# Altium project Reboostv2.PrjPcb
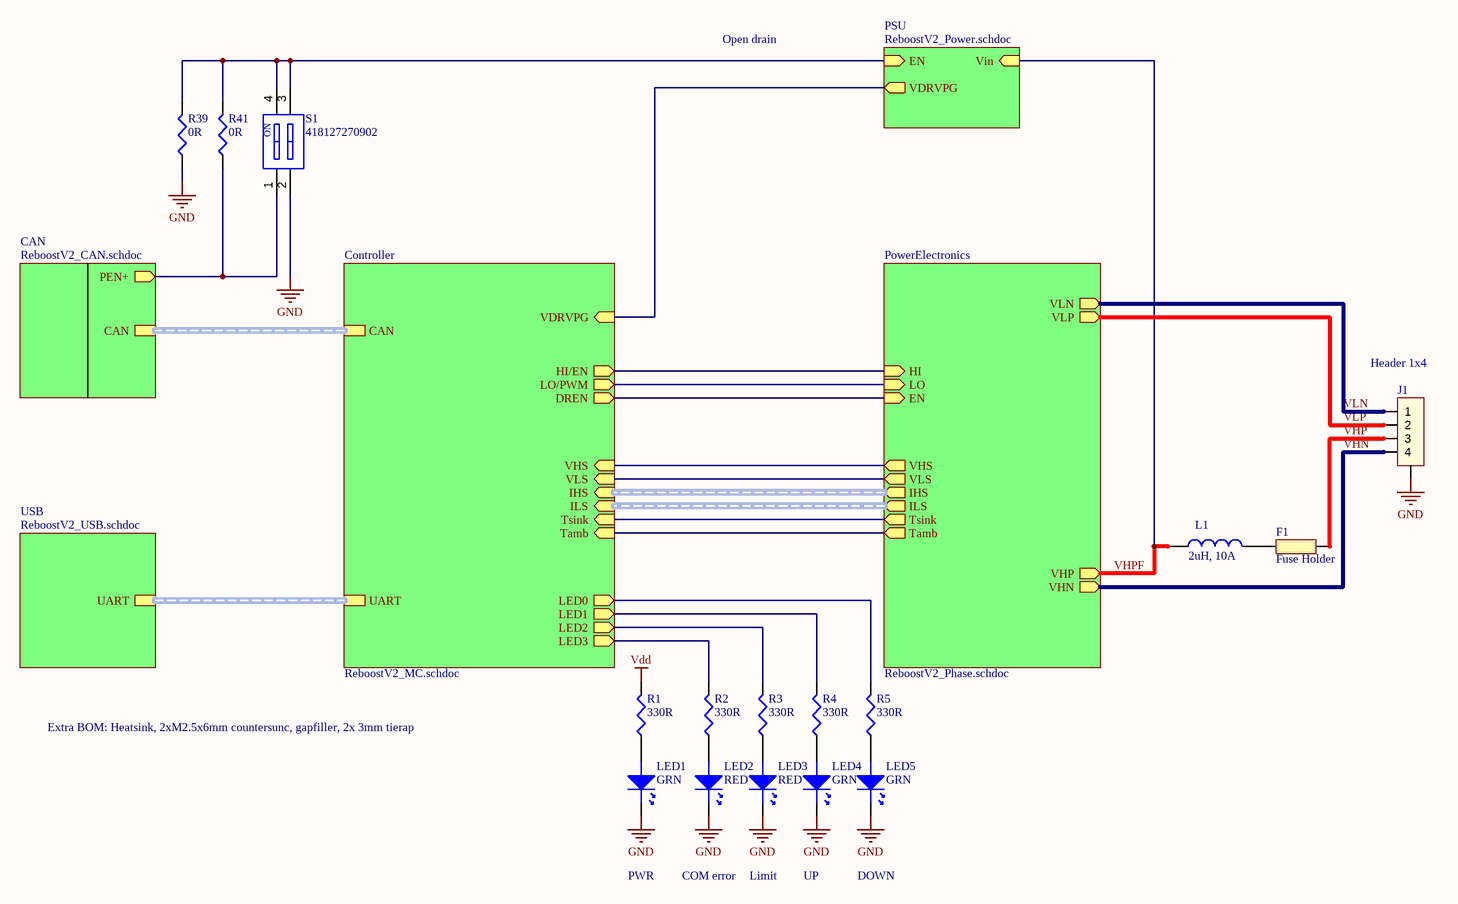
[diagram p0: ReboostV2_toplevel.SchDoc]
9 sheets, 177 parts. Net scope: hierarchical (ports join the sheet entries above them; power ports are global).
Board files: ReboostV2.PcbDoc, ReboostV2.1.PcbDoc
Sheets:
  ReboostV2_toplevel.SchDoc
    CAN = ReboostV2_CAN.SchDoc
    USB = ReboostV2_USB.SchDoc
    Controller = ReboostV2_MC.SchDoc
    PowerElectronics = ReboostV2_Phase.SchDoc
      ILS = ReboostV2__Isense.SchDoc
      IHS = ReboostV2__Isense.SchDoc
      VLS = ReboostV2__Vsense.SchDoc
      VHS = ReboostV2__Vsense.SchDoc
      Designator = ReboostV2_Bridge.SchDoc
    PSU = ReboostV2_Power.SchDoc

## Sheet ReboostV2_toplevel.SchDoc: ReboostV2 Top Sheet
size 420 x 297 mm; SheetNumber: 1

### Parts
F1  Fuse Holder  [Fuse5x20TH]
J1  Header 1x4  [PC 4/ 4-G-7,62]
L1  2uH, 10A  [744710210]
LED1  GRN  [WL-SMRW_1206 cylindrical_Reverse use]
LED2  RED  [WL-SMRW_1206 cylindrical_Reverse use]
LED3  RED  [WL-SMRW_1206 cylindrical_Reverse use]
LED4  GRN  [WL-SMRW_1206 cylindrical_Reverse use]
LED5  GRN  [WL-SMRW_1206 cylindrical_Reverse use]
R1  330R  [0603]
R2  330R  [0603]
R3  330R  [0603]
R4  330R  [0603]
R5  330R  [0603]
R39  0R  [0603]
R41  0R  [0603]
S1  418127270902  [418127270902]

### Sub-sheets
CAN = ReboostV2_CAN.schdoc: CAN, PEN+ (out)
Controller = ReboostV2_MC.schdoc: CAN (harness CAN), HI/EN (out), LO/PWM (out), UART (harness UART), LED1 (out), LED2 (out), LED3 (out), LED0 (out), VHS (in), VLS (in), Tsink (in), IHS (in, harness DP), ILS (in, harness DP), Tamb (in), DREN (out), VDRVPG (in)
PowerElectronics = ReboostV2_Phase.schdoc: VLP (out), VHP (out), Tsink (out), IHS (out), VHS (out), ILS (out), VLS (out), VHN (out), VLN (out), Tamb (out), HI (in), LO (in), EN (in)
PSU = ReboostV2_Power.schdoc: Vin (in), EN (in), VDRVPG (out)
USB = ReboostV2_USB.schdoc: UART (harness SERIAL)

### Nets
GND: J1.0 LED1.1(K) LED2.1(K) LED3.1(K) LED4.1(K) LED5.1(K) R39.1 S1.2
Vdd: R1.2
DREN: sheet Controller/DREN, sheet PowerElectronics/EN
HI: sheet Controller/HI/EN, sheet PowerElectronics/HI
LED0: R5.2 ; sheet Controller/LED0
LED1: R4.2 ; sheet Controller/LED1
LED2: R3.2 ; sheet Controller/LED2
LED3: R2.2 ; sheet Controller/LED3
LO: sheet Controller/LO/PWM, sheet PowerElectronics/LO
Tamb: sheet Controller/Tamb, sheet PowerElectronics/Tamb
Tsink: sheet Controller/Tsink, sheet PowerElectronics/Tsink
VDRVPG: sheet Controller/VDRVPG, sheet PSU/VDRVPG
VHN: J1.4 ; sheet PowerElectronics/VHN
VHP: F1.2 J1.3
VHPF: L1.1 ; sheet PowerElectronics/VHP, sheet PSU/Vin  [project net Vb]
VHS: sheet Controller/VHS, sheet PowerElectronics/VHS
VLN: J1.1 ; sheet PowerElectronics/VLN
VLP: J1.2 ; sheet PowerElectronics/VLP
VLS: sheet Controller/VLS, sheet PowerElectronics/VLS
NetD4_4: R41.1 S1.1 ; sheet CAN/PEN+
NetF1_1: F1.1 L1.2
NetLED1_2: LED1.2(A) R1.1
NetLED2_2: LED2.2(A) R2.1
NetLED3_2: LED3.2(A) R3.1
NetLED4_2: LED4.2(A) R4.1
NetLED5_2: LED5.2(A) R5.1
NetR38_2: R39.2 R41.2 S1.3 S1.4 ; sheet PSU/EN

### Buses and harness runs
harness sheet CAN/CAN = sheet Controller/CAN
harness sheet Controller/IHS = sheet PowerElectronics/IHS
harness sheet Controller/ILS = sheet PowerElectronics/ILS
harness sheet Controller/UART = sheet USB/UART

### Notes on the sheet
- Open drain
- Extra BOM: Heatsink, 2xM2.5x6mm countersunc, gapfiller, 2x 3mm tierap
- PWR
- COM error
- Limit
- UP
- DOWN
- PROJECT
- www.tpee.nl <http://www.tpee.nl>
- TITLE
- FILE NAME
- A3
- SIZE
- Author:
- SHEET
- OF
- (in symbol 418127270902) ON

### Library data of the parts
F1 = 0031.8201: Fuse, Holder, 10A, 250V, T:-40°C +85°C; Brand: SCHURTER; Price: 0,43; Order Code Supplier: 1162740; Brand Number: 0031.8201; Supplier: Farnell
J1 = PC 4/4-G-7,62_1: Header, Close Horizontal, 1x4, Male, 7.62mm, TH; Brand: PHOENIX CONTACT; Brand Number: PC 4/4-G-7,62; Case Style: *; Order Code Supplier: 1792930; Pitch: 7.62mm; Price: 2,92; Supplier: Farnell
L1 = 744710210: WE-SD Rod Core Choke, 2uH, 10A; Manufacturer: Wurth Elektronik; DC Resistance: 3.8mOhm; ComponentLink1Description: Manufacturer; ComponentLink1URL: http://www.we-online.de; ComponentLink2Description: Datasheet; ComponentLink2URL: https://www.we-online.com/catalog/datasheet/744710210.pdf; Operating Temperature: -40 to +150degC; Packaging: Carton; Published Date: April 2020; Inductance: 2uH; Manufacturer Part Number: 744710210; Mounting Technology: THT; Rated Current: 10A
LED1 LED4 LED5 = 156120GS75300: LED, Reverse Mount, Cylindrical, Green; Brand: Wurth; Order Code Supplier: 2322091; Supplier: Farnell; Price: 0,519; Brand Number: 156120GS75300
LED2 LED3 = 156120RS75300: LED, Reverse Mount, Cylindrical, Red; Brand: Wurth; Order Code Supplier: 2322094; Supplier: Farnell; Price: 0,519; Brand Number: 156120RS75300
R1-R5 = 330/0603/0063W/50V: Resistor, 330R, 1%, 0.063W, 50V, 100PPM, 0603; Brand: VISHAY DRALORIC; Brand Number: CRCW0603330RFKEA; Case Style: 0603; Order Code Supplier: 2122302; Power Rating: 0.063W; Price: 0,038; Resistance: 330R; Supplier: Farnell; Temperature Coefficient: ± 100PPM; Temperature Range: -55°C to +125°C; Voltage Rating: 50V
R39 R41 = 0/0603/0063W/50V: Resistor, 0R, 0.1%, 0.063W, 50V, 200PPM, 0603; Brand: VISHAY DRALORIC; Brand Number: CRCW06030000Z0EA; Case Style: 0603; Order Code Supplier: 2122112; Power Rating: 0.063W; Price: 0,043; Resistance: 0R; Supplier: Farnell; Temperature Coefficient: ± 200PPM; Temperature Range: -55°C to +125°C; Voltage Rating: 50V
S1 = 418127270902: WS-DITV Small Compact THT Dip Switch, Raised Actuator, pitch 2.54mm, 2p; Operation Force: 600g; Pole Number: 2; Actuator Type: Raise Type; Circuit: SPST-NO; Rated Current Switching: 25mA; Rated Current Non-Switching: 100mA; Rated Voltage Non-Switching: 50VDC; Rated Voltage Switching: 24VDC; ComponentLink1Description: Manufacturer; ComponentLink1URL: http://www.we-online.de; ComponentLink2Description: Datasheet; ComponentLink2URL: https://katalog.we-online.com/em/datasheet/418127270902.pdf; Pitch: 2.54mm; Contact Material: Copper Alloy; Mounting Technology: THT; Operating Temperature: -40 to +85degC; Contact Plating: Gold; Packaging: Tube; Part Number: 418127270902; Publisher: Wurth Elektronik; Published Date: September 2019

## Sheet ReboostV2_CAN.SchDoc: CAN
size 420 x 297 mm; SheetNumber: 9
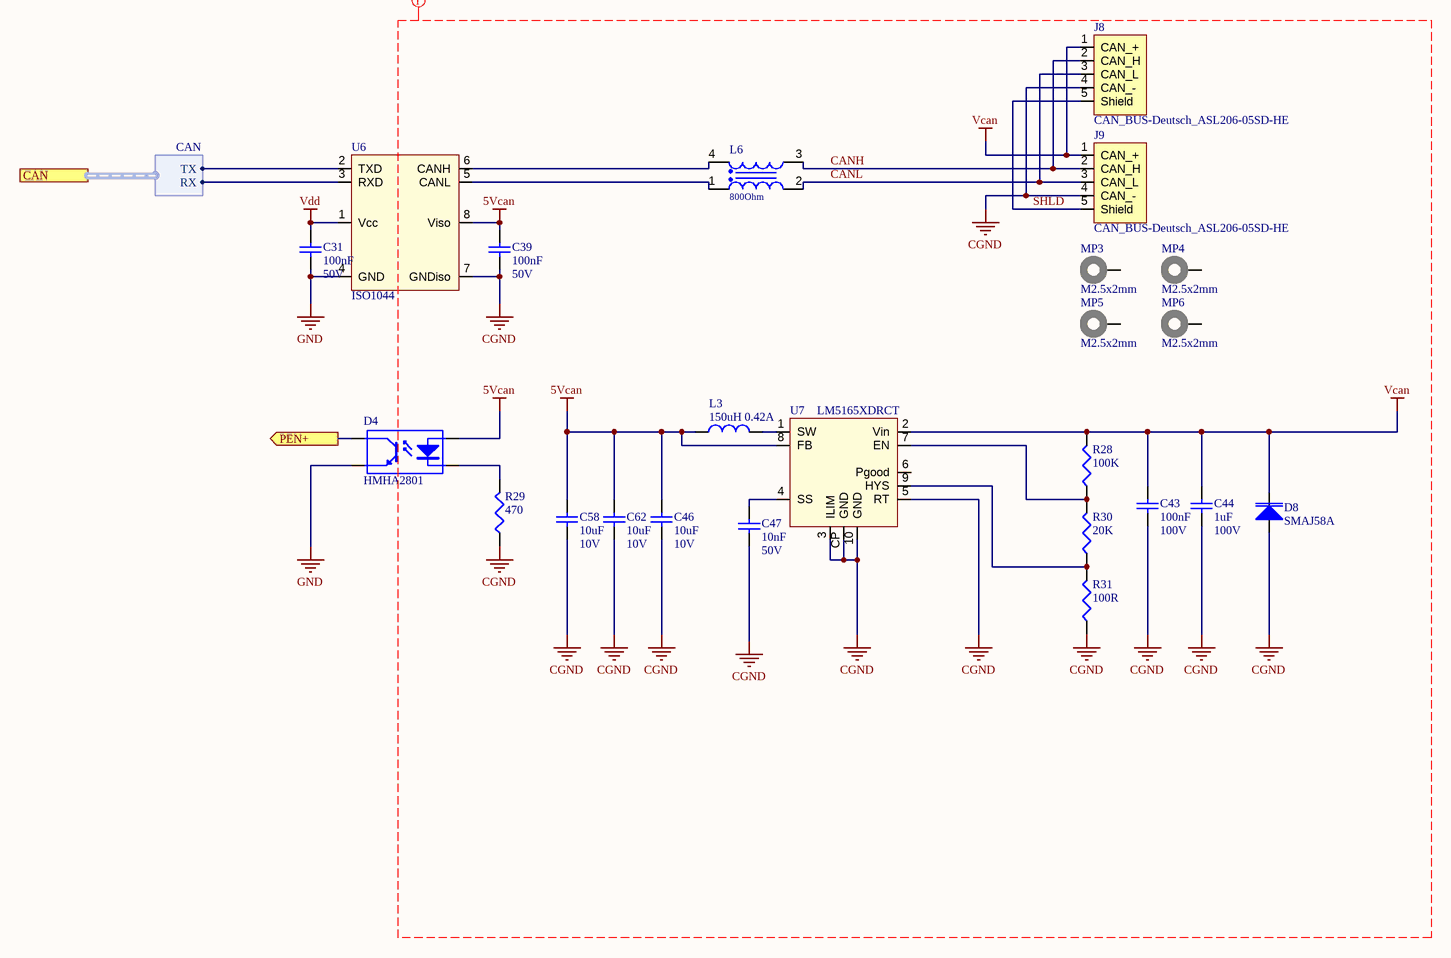
[diagram p1: ReboostV2_CAN.SchDoc]

### Parts
C31  100nF  Voltage Rating: 50V  [C0603]
C39  100nF  Voltage Rating: 50V  [C0603]
C43  100nF  Voltage Rating: 100V  [C-0805]
C44  1uF  Voltage Rating: 100V  [C-1206]
C46  10uF  Voltage Rating: 10V  [C-0805]
C47  10nF  Voltage Rating: 50V  [C0603]
C58  10uF  Voltage Rating: 10V  [C-0805]
C62  10uF  Voltage Rating: 10V  [C-0805]
D4  HMHA2801  [FSOP4]
D8  SMAJ58A  [SMA]
J8  CAN_BUS-Deutsch_ASL206-05SD-HE  [ASL206-05SD-HE]
J9  CAN_BUS-Deutsch_ASL206-05SD-HE  [ASL206-05SD-HE]
L3  150uH 0.42A  [WE-TPC 4828, MH]
L6  800Ohm  [WE-CNSW_1812]
MP3  M2.5x2mm  [9774020151]
MP4  M2.5x2mm  [9774020151]
MP5  M2.5x2mm  [9774020151]
MP6  M2.5x2mm  [9774020151]
R28  100K  [0603]
R29  470  [0603]
R30  20K  [0603]
R31  100R  [0603]
U6  ISO1044  [SO-8]
U7  LM5165XDRCT  [PWSON10]

### Ports
CAN (harness CAN), PEN+ (out)

### Harnesses
CAN: TX, RX

### Nets
5Vcan: C39.2 C46.2 C58.2 C62.2 D4.1(A1) L3.2 U6.8(Viso) U7.8(FB)
CGND: C39.1 C43.1 C44.1 C46.1 C47.1 C58.1 C62.1 D8.1 J8.4(CAN_-) J9.4(CAN_-) R29.1 R31.1 U6.7(GNDiso) U7.3(ILIM) U7.5(RT) U7.10(GND) U7.CP(GND)
GND: C31.1 D4.3(E1) U6.4(GND)
Vcan: C43.2 C44.2 D8.2 J8.1(CAN_+) J9.1(CAN_+) R28.2 U7.2(Vin)
Vdd: C31.2 U6.1(Vcc)
CANH: J8.2(CAN_H) J9.2(CAN_H) L6.3
CANL: J8.3(CAN_L) J9.3(CAN_L) L6.2
CANRX: U6.3(RXD) ; port CAN.RX
CANTX: U6.2(TXD) ; port CAN.TX
SHLD: J8.5(Shield) J9.5(Shield)
NetC47_2: C47.2 U7.4(SS)
NetD4_2: D4.2(K1) R29.2
NetD4_4: D4.4(C1) ; port PEN+
NetL3_1: L3.1 U7.1(SW)
NetL6_1: L6.1 U6.5(CANL)
NetL6_4: L6.4 U6.6(CANH)
NetR28_1: R28.1 R30.2 U7.7(EN)
NetR30_1: R30.1 R31.2 U7.9(HYS)

Not connected (* = marked no-connect by the designer): MP3 1; MP4 1; MP5 1; MP6 1; U7 6(Pgood)

### Layout directives
net class CANISO: 5Vcan, CANH, CANL, CGND, SHLD, Vcan

### Notes on the sheet
- PROJECT
- www.tpee.nl <http://www.tpee.nl>
- TITLE
- FILE NAME
- A3
- SIZE
- Author:
- SHEET
- OF

### Library data of the parts
C31 C39 = 100nF/0603/CER/50V: Capacitor, 100nF, 50V, X7R; Capacitance Tolerance: ± 10%; Capacitor Case Style: 0603; Brand Number: MCCA000255; Brand: MULTICOMP; Dielectric Characteristic: X7R; Capacitance: 100nF; Temperature Range: -55°C to +125°C; Price: 0,008; Order Code Supplier: 1759122RL; Supplier: Farnell
C43 = 100nF/0805/CER/100V: Capacitor, 100nF, 100V, X7R; Capacitance Tolerance: ± 10%; Capacitor Case Style: 0805; Brand Number: C0805C104K1RACTU; Brand: KEMET; Dielectric Characteristic: X7R; Capacitance: 100nF; Temperature Range: -55°C to +125°C; Price: 0,096; Order Code Supplier: 1650862; Supplier: Farnell
C44 = 1uF/1206/CER/100V: Capacitor, 1uF, 100V, X7R; Capacitance Tolerance: ± 10%; Capacitor Case Style: 1206; Brand Number: 12061C105K4Z2A; Brand: AVX; Dielectric Characteristic: X7R; Capacitance: 1uF; Temperature Range: -55°C to +125°C; Price: 0,52; Order Code Supplier: 1833855; Supplier: Farnell
C46 C58 C62 = 10uF/0805/CER/10V: Capacitor, 10uF, 10V, X7R; Capacitance Tolerance: ± 10%; Capacitor Case Style: 0805; Brand Number: GRM21BR71A106KE51L; Brand: MURATA; Dielectric Characteristic: X7R; Capacitance: 10uF; Temperature Range: -55°C to +125°C; Price: 0,36; Order Code Supplier: 1828828; Supplier: Farnell
C47 = 10nF/0603/CER/50V: Capacitor, 10nF, 50V, X7R; Capacitance Tolerance: ± 10%; Capacitor Case Style: 0603; Brand Number: C0603C103K5RACTU; Brand: KEMET; Dielectric Characteristic: X7R; Capacitance: 10nF; Temperature Range: -55°C to +125°C; Price: 0,011; Order Code Supplier: 1414609; Supplier: Farnell
D4 = HMHA2801: Optocoupler, Vout:80V, Iin:0.01A; Brand: FAIRCHILD SEMICONDUCTOR; Isolation Voltage: 2500V; Input Current: 0.01A; Output Voltage: 80V; Brand Number: HMHA2801; Case Style: *; Price: 0,28; Order Code Supplier: 1652504; Supplier: Farnell; Temperature Range: -55°C to +100°C
D8 = SMAJ58A: Diode TVS, Vrwm: 58V, Vbr: 71.2V, Vc: 93.6V, Ippm: 4.3A; Brand: MULTICOMP; Brand Number: SMAJ58A; Breakdown Voltage: 71.2V; Case Style: SMA; Clamping Voltage: 93.6V; Ippm: 4.3A; Order Code Supplier: 1579005; Price: 0,166; Supplier: Farnell; Temperature Range: -55°C to +150°C; Vrwm: 58V
J8 J9 = CMP-024-0003-1: Design Item ID: CAN_BUS-Deutsch_ASL206-05SD-HE; Source: Deutsch_lib.SchLib
L3 = 744043151: 150UH, 30%, 0.42A; Brand: Wurth; Case Style: WE-TPC 4828; DC Resistance: 0.770ohm; Brand Number: 744043151; DC Current: 0.42A; Inductance: 150uH; Order Code Supplier: 2082517; Price: 1,36; Q Factor: *; Supplier: Farnell; Temperature Range: -40°C to +125°C
L6 = 744235801: WE-CNSW SMT Common Mode Line Filter, size 1812, 800Ohm, 1A, 60V; Manufacturer: Wurth Elektronik; DC Resistance max.: 0.12Ohm; Impedance Test Condition: 100MHz; Insulation Test Voltage: 125VAC; Winding Style: bifiliar; ComponentLink1Description: Manufacturer; ComponentLink1URL: http://www.we-online.de; ComponentLink2Description: Datasheet; ComponentLink2URL: https://www.we-online.com/catalog/datasheet/744235801.pdf; Operating Temperature: -40 to +125degC; Packaging: Tape and Reel; Published Date: April 2020; Rated Current: 1A; Size: 1812; Impedance: 800Ohm; Manufacturer Part Number: 744235801; Rated Voltage: 60V; Mounting Technology: SMT
MP3-MP6 = 9774020151: WA-SMSI SMT Steel Spacer, M2.5 Thread Internal, OD 5.1mm, M2.5x2mm; Manufacturer: Wurth Elektronik; Inner Diameter: 3.5mm; Surface: Tin; ComponentLink1Description: Manufacturer; ComponentLink1URL: http://www.we-online.de; ComponentLink2Description: Datasheet; ComponentLink2URL: https://www.we-online.com/catalog/datasheet/9774020151.pdf; Mounting Technology: SMT; Packaging: Bulk; Manufacturer Part Number: 9774020151; Length: 2mm; Inner Thread Length: -; Operating Temperature: -55 to +150degC; Outer Diameter: 5.1mm; Published Date: April 2020; Material: Steel; Thread: M2.5
R28 = 100K/0603/0063W/50V: Resistor, 100K, 1%, 0.063W, 50V, 100PPM, 0603; Brand: VISHAY DRALORIC; Brand Number: CRCW0603100KFKEA; Case Style: 0603; Order Code Supplier: 2122619; Power Rating: 0.063W; Price: 0,039; Resistance: 100K; Supplier: Farnell; Temperature Coefficient: ± 100PPM; Temperature Range: -55°C to +125°C; Voltage Rating: 50V
R29 = 470/0603/0063W/50V: Resistor, 470, 1%, 0.063W, 50V, 100PPM, 0603; Brand: VISHAY DRALORIC; Brand Number: CRCW0603470RFKEA; Case Style: 0603; Order Code Supplier: 2122323; Power Rating: 0.063W; Price: 0,038; Resistance: 470; Supplier: Farnell; Temperature Coefficient: ± 100PPM; Temperature Range: -55°C to +125°C; Voltage Rating: 50V
R30 = 20K/0603/0063W/50V: Resistor, 20K, 1%, 0.063W, 50V, 100PPM, 0603; Brand: VISHAY DRALORIC; Brand Number: CRCW060320K0FKEA; Case Style: 0603; Order Code Supplier: 2122528; Power Rating: 0.063W; Price: 0,038; Resistance: 20K; Supplier: Farnell; Temperature Coefficient: ± 100PPM; Temperature Range: -55°C to +125°C; Voltage Rating: 50V
R31 = 100/0603/0063W/50V: Resistor, 100R, 1%, 0.063W, 50V, 200PPM, 0603; Brand: VISHAY DRALORIC; Brand Number: CRCW0603100RFKEA; Case Style: 0603; Order Code Supplier: 2122239; Power Rating: 0.063W; Price: 0,007; Resistance: 100R; Supplier: Farnell; Temperature Coefficient: ± 200PPM; Temperature Range: -55°C to +125°C; Voltage Rating: 50V
U6 = ISO1044: ISO1044 Isolated CAN FD Transceiver in Small Package; Supplier 1: Digi-Key; Supplier 2: Mouser; Supplier Part Number 1: 296-ISO1044DEVM-ND; Supplier Part Number 2: 595-ISO1044DEVM
U7 = LM5165X: Buck Vreg 150mA 5Vout 5-65Vin; Brand: Texas Instruments; Case Style: MSOP-8; Price: 3,70; Order Code Supplier: 595-LM5165XDRCT; Brand Number: LM5165XDRCT; Temperature Range: -40°C to +85°C; Supplier: Mouser

## Sheet ReboostV2_USB.SchDoc: USB
size 420 x 297 mm; SheetNumber: 7
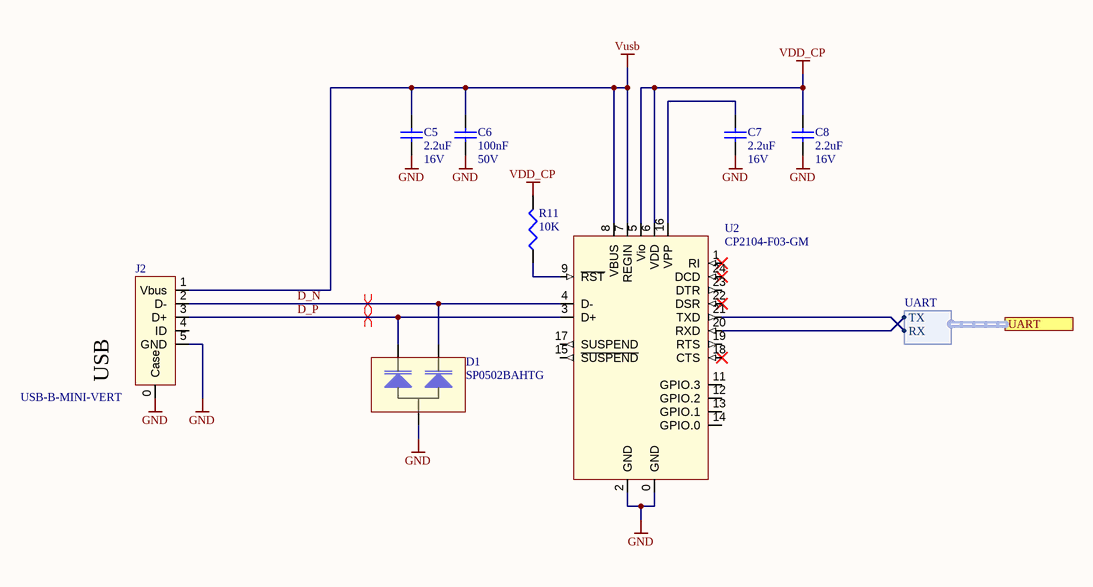
[diagram p2: ReboostV2_USB.SchDoc]

### Parts
C5  2.2uF  Voltage Rating: 16V  [C0603]
C6  100nF  Voltage Rating: 50V  [C0603]
C7  2.2uF  Voltage Rating: 16V  [C0603]
C8  2.2uF  Voltage Rating: 16V  [C0603]
D1  SP0502BAHTG  [SOT23]
J2  USB-B-MINI-VERT  [USB-B-MINI-VERT]
R11  10K  [0603]
U2  CP2104-F03-GM  [QFN24]

### Ports
UART (harness UART)

### Harnesses
UART: RX, TX

### Nets
GND: C5.1 C6.1 C7.1 C8.1 D1.A J2.0(Case) J2.5(GND) U2.0(GND) U2.2(GND)
VDD_CP: C8.2 R11.2 U2.5(Vio) U2.6(VDD)
Vusb: C5.2 C6.2 J2.1(Vbus) U2.7(REGIN) U2.8(VBUS)
D_N: D1.K1 J2.2(D-) U2.4(D-)
D_P: D1.K2 J2.3(D+) U2.3(D+)
RX: U2.21(TXD) ; port UART.RX
TX: U2.20(RXD) ; port UART.TX
NetC7_2: C7.2 U2.16(VPP)
NetR11_1: R11.1 U2.9(~{RST})

Not connected (* = marked no-connect by the designer): J2 4(ID); U2 1(RI)* 11(GPIO.3) 12(GPIO.2) 13(GPIO.1) 14(GPIO.0) 15(~{SUSPEND}) 17(SUSPEND) 18(CTS)* 19(RTS) 22(DSR)* 23(DTR) 24(DCD)*

### Layout directives
differential pair: D_N, D_P

### Notes on the sheet
- (near J2) USB
- PROJECT
- www.tpee.nl <http://www.tpee.nl>
- TITLE
- FILE NAME
- A3
- SIZE
- Author:
- SHEET
- OF

### Library data of the parts
C5 C7 C8 = 2.2uF/0603/CER/16V: Capacitor, 2.2uF, 16V, X5R; Capacitance Tolerance: +/- 10%; Capacitor Case Style: 0603; Brand Number: GRM188R61C225KE15D; Brand: MURATA; Dielectric Characteristic: X5R; Capacitance: 2.2uF; Temperature Range: -55°C to 85°C; Price: 0,077; Order Code Supplier: 1735526; Supplier: Farnell
C6 = 100nF/0603/CER/50V: as C31 on sheet ReboostV2_CAN; Dielectric Characteristic: X7R; Capacitance: 100nF; Temperature Range: -55°C to +125°C; Price: 0,008; Order Code Supplier: 1759122RL; Supplier: Farnell
D1 = SP0502BAHTG: Diode TVS Dual, Vrwm: 5.5V Vc: 8V; Brand: LITTLEFUSE; Case Style: SOT-23; Brand Number: SP0502BAHTG; Clamping Voltage: 8V; Order Code Supplier: 1827631; Price: 0,80; Supplier: Farnell; Temperature Range: -40°C to +125°C; Vrwm: 5.5V
J2 = WE-651005136421: Connector, Usb B Mini, Vertical, TH, WR-COM; Brand: WURTH ELEKTRONIK; Brand Number: 651005136421; Case Style: WR-COM; Order Code Supplier: 1841175; Pitch: *; Price: 3,37; Supplier: Farnell
R11 = 10K/0603/0063W/50V: Resistor, 10K, 1%, 0.063W, 50V, 100PPM, 0603; Brand: VISHAY DRALORIC; Brand Number: CRCW060310K0FKEA; Case Style: 0603; Order Code Supplier: 2122493; Power Rating: 0.063W; Price: 0,038; Resistance: 10K; Supplier: Farnell; Temperature Coefficient: ± 100PPM; Temperature Range: -55°C to +125°C; Voltage Rating: 50V
U2 = CP2104-F03-GM: USB to UART converter; Brand: Silicon Labs; Case Style: QFN24; Price: 1,65; Order Code Supplier: 757-4983; Brand Number: CP2104-F03-GM; Supplier: RS-Components

## Sheet ReboostV2_MC.SchDoc: Microcontroller
size 420 x 297 mm; SheetNumber: 6
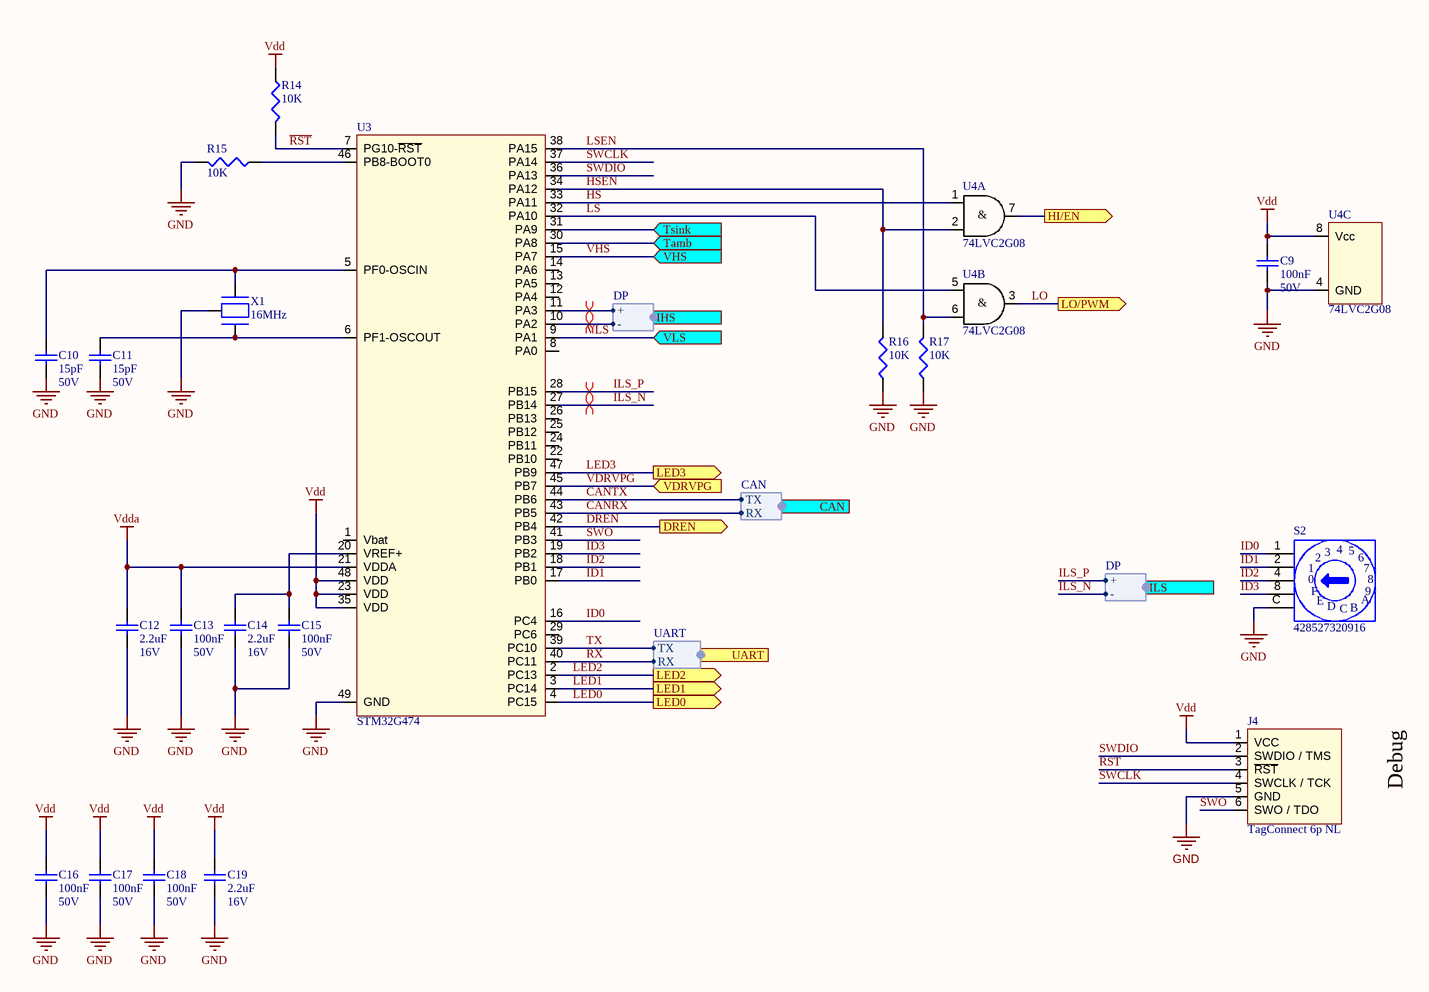
[diagram p3: ReboostV2_MC.SchDoc]

### Parts
C9  100nF  Voltage Rating: 50V  [C0603]
C10  15pF  Voltage Rating: 50V  [C0603]
C11  15pF  Voltage Rating: 50V  [C0603]
C12  2.2uF  Voltage Rating: 16V  [C0603]
C13  100nF  Voltage Rating: 50V  [C0603]
C14  2.2uF  Voltage Rating: 16V  [C0603]
C15  100nF  Voltage Rating: 50V  [C0603]
C16  100nF  Voltage Rating: 50V  [C0603]
C17  100nF  Voltage Rating: 50V  [C0603]
C18  100nF  Voltage Rating: 50V  [C0603]
C19  2.2uF  Voltage Rating: 16V  [C0603]
J4  TagConnect 6p NL  [TC2030-IDC-NL]  (no BOM)
R14  10K  [0603]
R15  10K  [0603]
R16  10K  [0603]
R17  10K  [0603]
S2  428527320916  [42852732091x_16p]
U3  STM32G474  [QFN48]
U4  74LVC2G08  [TSSOP8]  (parts A,B,C of 3)
X1  16MHz  [7M]

### Ports
CAN (harness CAN), DREN (out), HI/EN (out), IHS (harness DP), ILS (harness DP), LED0 (out), LED1 (out), LED2 (out), LED3 (out), LO/PWM (out), Tamb (in), Tsink (in), UART (harness UART), VDRVPG (in), VHS (in), VLS (in)

### Harnesses
CAN: RX, TX
UART: RX, TX
DP: +, -

### Nets
GND: C9.1 C10.1 C11.1 C12.1 C13.1 C14.1 C15.1 C16.1 C17.1 C18.1 C19.1 J4.5(GND) R15.2 R16.1 R17.1 S2.C U3.49(GND) U4.4(GND) X1.0
Vdd: C9.2 C16.2 C17.2 C18.2 C19.2 J4.1(VCC) R14.1 U3.23(VDD) U3.35(VDD) U3.48(VDD) U4.8(Vcc)
Vdda: C12.2 C13.2 U3.21(VDDA)
_N: U3.10(PA2) ; port IHS.-
_P: U3.11(PA3) ; port IHS.+
CANRX: U3.43(PB5) ; port CAN.RX
CANTX: U3.44(PB6) ; port CAN.TX
DREN: U3.42(PB4) ; port DREN
HI: U4.7(Y) ; port HI/EN
HS: U3.33(PA11) U4.1(A)
HSEN: R16.2 U3.34(PA12) U4.2(B)
ID0: S2.1 U3.16(PC4)
ID1: S2.2 U3.17(PB0)
ID2: S2.4 U3.18(PB1)
ID3: S2.8 U3.19(PB2)
ILS_N: U3.27(PB14) ; port ILS.-  [project net _N]
ILS_P: U3.28(PB15) ; port ILS.+  [project net _P]
LED0: U3.4(PC15) ; port LED0
LED1: U3.3(PC14) ; port LED1
LED2: U3.2(PC13) ; port LED2
LED3: U3.47(PB9) ; port LED3
LO: U4.3(Y) ; port LO/PWM
LS: U3.32(PA10) U4.5(A)
LSEN: R17.2 U3.38(PA15) U4.6(B)
~{RST}: J4.3(~{RST}) R14.2 U3.7(PG10-~{RST})
RX: U3.40(PC11) ; port UART.RX
SWCLK: J4.4(SWCLK_/_TCK) U3.37(PA14)
SWDIO: J4.2(SWDIO_/_TMS) U3.36(PA13)
SWO: J4.6(SWO_/_TDO) U3.41(PB3)
Tamb: U3.30(PA8) ; port Tamb
Tsink: U3.31(PA9) ; port Tsink
TX: U3.39(PC10) ; port UART.TX
VDRVPG: U3.45(PB7) ; port VDRVPG
VHS: U3.15(PA7) ; port VHS
VLS: U3.9(PA1) ; port VLS
NetC10_2: C10.2 U3.5(PF0-OSCIN) X1.1
NetC11_2: C11.2 U3.6(PF1-OSCOUT) X1.2
NetC14_2: C14.2 C15.2 U3.20(VREF+)
NetR15_1: R15.1 U3.46(PB8-BOOT0)

Not connected (* = marked no-connect by the designer): U3 1(Vbat) 8(PA0) 12(PA4) 13(PA5) 14(PA6) 22(PB10) 24(PB11) 25(PB12) 26(PB13) 29(PC6)

### Layout directives
differential pair: _N, _P

### Notes on the sheet
- Debug
- PROJECT
- www.tpee.nl <http://www.tpee.nl>
- TITLE
- FILE NAME
- A3
- SIZE
- Author:
- SHEET
- OF
- (in symbol 74LVC2G08, part A) &
- (in symbol 74LVC2G08, part B) &
- (in symbol 428527320916) 5; 3; 6; 7; 0; F; 9; E; A; D; B

### Library data of the parts
C9 C13 C15-C18 = 100nF/0603/CER/50V: as C31 on sheet ReboostV2_CAN; Dielectric Characteristic: X7R; Capacitance: 100nF; Temperature Range: -55°C to +125°C; Price: 0,008; Order Code Supplier: 1759122RL; Supplier: Farnell
C10 C11 = 15pF/0603/CER/50V: Capacitor, 15pF, 50V, C0G / NP0; Capacitance Tolerance: ± 5%; Capacitor Case Style: 0603; Brand Number: MCCA000194; Brand: MULTICOMP; Dielectric Characteristic: C0G / NP0; Capacitance: 15pF; Temperature Range: -55°C to +125°C; Price: 0,009; Order Code Supplier: 1759055; Supplier: Farnell
C12 C14 C19 = 2.2uF/0603/CER/16V: as C5 on sheet ReboostV2_USB; Dielectric Characteristic: X5R; Capacitance: 2.2uF; Temperature Range: -55°C to 85°C; Price: 0,077; Order Code Supplier: 1735526; Supplier: Farnell
J4 = TC2030-IDC: “No Legs” 6-pin Plug-of-Nails™ Cable fitted with a 6-pin 0.1″ pitch ribbon connector.
R14-R17 = 10K/0603/0063W/50V: as R11 on sheet ReboostV2_USB; Case Style: 0603; Order Code Supplier: 2122493; Power Rating: 0.063W; Price: 0,038; Resistance: 10K; Supplier: Farnell; Temperature Coefficient: ± 100PPM; Temperature Range: -55°C to +125°C; Voltage Rating: 50V
S2 = 428527320916: WS-ROTV THT Rotary Switch with Arrow Type Actuator, 10x10mm, 16 positions; Rated Current: 150mA; Cover Material: PA66; Position Number: 16; Washable: Yes; Rated Voltage: 24VDC; ComponentLink1Description: Manufacturer; ComponentLink1URL: http://www.we-online.de; ComponentLink2Description: Datasheet; ComponentLink2URL: https://katalog.we-online.com/em/datasheet/428527320916.pdf; Part Number: 428527320916; Publisher: Wurth Elektronik; Operating Temperature: -40 to +85degC; Packaging: Tube; Mounting Technology: THT; Published Date: September 2019; Size: 10x10mm; Terminal Plating: Gold; Actuator Type: Arrow Type
U3 = STM32G474CEU6: ARM MCU, STM32 Family STM32G4 Series Microcontrollers, ARM Cortex-M4F, 32bit, 170 MHz, 512 KB; Supplier 1: Digi-Key; Supplier 2: Farnell; Supplier Part Number 1: 497-STM32G474CEU6-ND; Supplier Part Number 2: 3132392
U4 = 74LVC2G08: Dual 2-input AND gate; Supplier: Mouser; Order Code Supplier: 771-74LVC2G08DP-G
X1 = 7M-16.000MAAJ-T: CRYSTAL, 16MHz,18PF CL, 3.2X2.5MM SMT; Brand: TXC; Order Code Supplier: 1842060; Price: 1,45; Supplier: Farnell; Brand Number: 7M-16.000MAAJ-T

## Sheet ReboostV2_Phase.SchDoc: Power Electronics
size 420 x 297 mm; DocumentNumber: 2; SheetNumber: 2
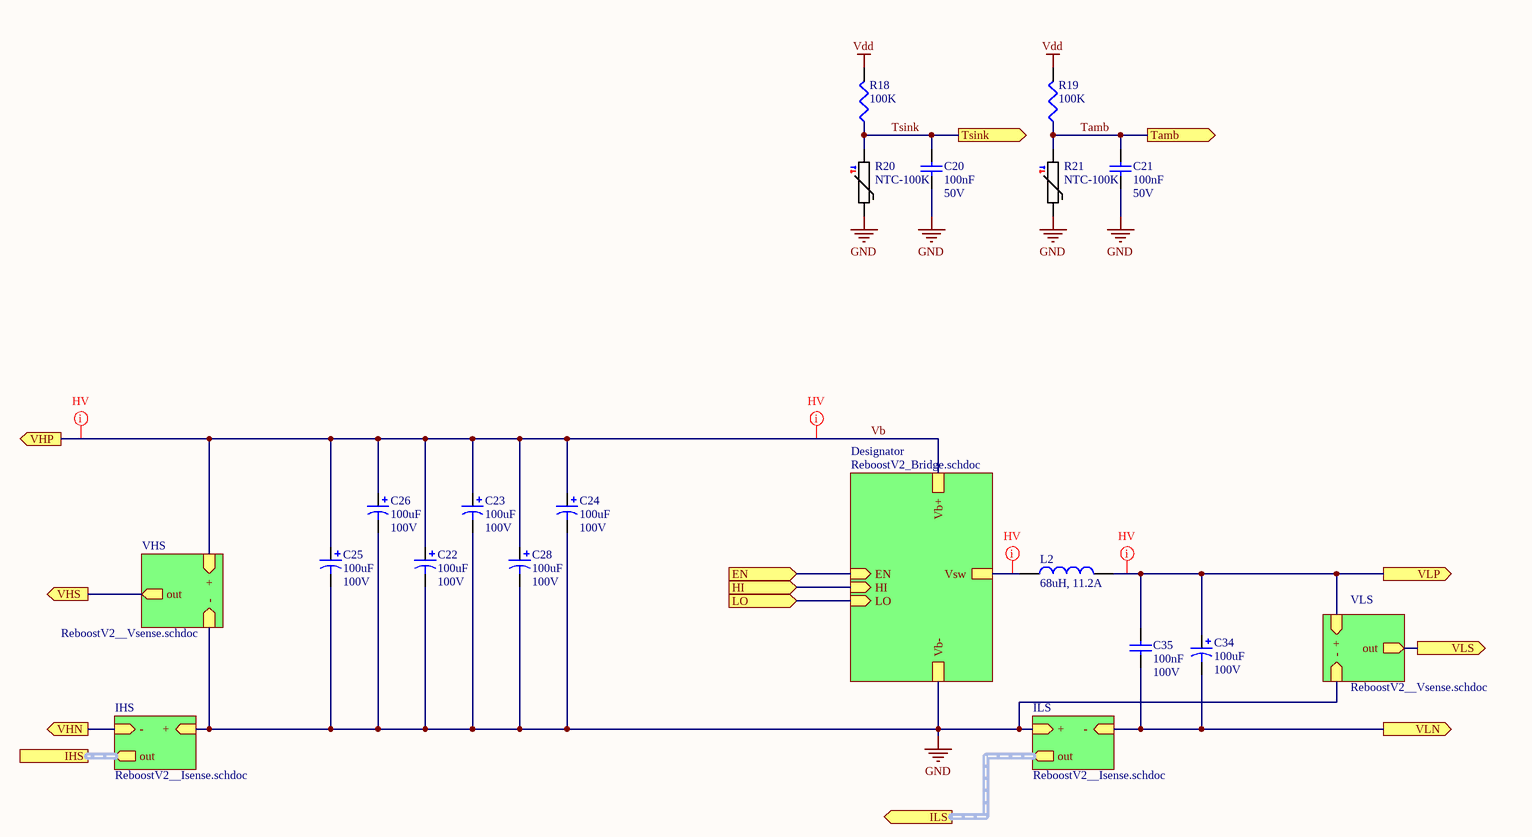
[diagram p4: ReboostV2_Phase.SchDoc]

### Parts
C20  100nF  Voltage Rating: 50V  [C0603]
C21  100nF  Voltage Rating: 50V  [C0603]
C22  100uF  Voltage Rating: 100V  [WCAP-ATUL_10x20x5x0.6]
C23  100uF  Voltage Rating: 100V  [WCAP-ATUL_10x20x5x0.6]
C24  100uF  Voltage Rating: 100V  [WCAP-ATUL_10x20x5x0.6]
C25  100uF  Voltage Rating: 100V  [WCAP-ATUL_10x20x5x0.6]
C26  100uF  Voltage Rating: 100V  [WCAP-ATUL_10x20x5x0.6]
C28  100uF  Voltage Rating: 100V  [WCAP-ATUL_10x20x5x0.6]
C34  100uF  Voltage Rating: 100V  [WCAP-ATUL_10x20x5x0.6]
C35  100nF  Voltage Rating: 100V  [C-0805]
L2  68uH, 11.2A  [WE-HCF_2920]
R18  100K  [0603]
R19  100K  [0603]
R20  NTC-100K  [R0805]
R21  NTC-100K  [R0805]

### Sub-sheets
Designator = ReboostV2_Bridge.schdoc: Vb+, Vsw, Vb-, EN (in), HI (in), LO (in)
IHS = ReboostV2__Isense.schdoc: - (in), + (in), out (out)
ILS = ReboostV2__Isense.schdoc: - (in), + (in), out (out)
VHS = ReboostV2__Vsense.schdoc: + (in), out (out), - (in)
VLS = ReboostV2__Vsense.schdoc: + (in), out (out), - (in)

### Ports
EN (in), HI (in), IHS, ILS (out), LO (in), Tamb (out), Tsink (out), VHN (out), VHP (out), VHS (out), VLN (out), VLP (out), VLS (out)

### Nets
GND: C20.1 C21.1 C22.2 C23.2 C24.2 C25.2 C26.2 C28.2 R20.1 R21.1 ; sheet ILS/+, sheet IHS/+, sheet VLS/-, sheet VHS/-, sheet Designator/Vb-
Vdd: R18.2 R19.2
DREN: port EN, sheet Designator/EN
HI: port HI, sheet Designator/HI
HSS: L2.1 ; sheet Designator/Vsw
LO: port LO, sheet Designator/LO
Tamb: C21.2 R19.1 R21.2 ; port Tamb
Tsink: C20.2 R18.1 R20.2 ; port Tsink
Vb: C22.1 C23.1 C24.1 C25.1 C26.1 C28.1 ; port VHP, sheet VHS/+, sheet Designator/Vb+
VHN: port VHN, sheet IHS/-
VHS: port VHS, sheet VHS/out
VLN: C34.2 C35.1 ; port VLN, sheet ILS/-
VLP: C34.1 C35.2 L2.2 ; port VLP, sheet VLS/+
VLS: port VLS, sheet VLS/out

### Buses and harness runs
harness port IHS = sheet IHS/out
harness port ILS = sheet ILS/out

### Layout directives
net class HV: HSS, Vb, VLP

### Notes on the sheet
- PROJECT
- www.tpee.nl <http://www.tpee.nl>
- TITLE
- FILE NAME
- A3
- SIZE
- Author:
- SHEET
- OF

### Library data of the parts
C20 C21 = 100nF/0603/CER/50V: as C31 on sheet ReboostV2_CAN; Dielectric Characteristic: X7R; Capacitance: 100nF; Temperature Range: -55°C to +125°C; Price: 0,008; Order Code Supplier: 1759122RL; Supplier: Farnell
C22-C26 C28 C34 = 100uF/ALU/100V: Aluminum Electrolytic Capacitor, 100uF, 100V; Capacitance Tolerance: ± 20%; Capacitor Case Style: Radial Leaded 10 x 20; Dielectric Characteristic: *; Capacitance: 100uF; Temperature Range: -40°C to +85°C; Supplier 1: Mouser; Supplier Part Number 1: 661-EKYB101E101MJ20S
C35 = 100nF/0805/CER/100V: as C43 on sheet ReboostV2_CAN; Dielectric Characteristic: X7R; Capacitance: 100nF; Temperature Range: -55°C to +125°C; Price: 0,096; Order Code Supplier: 1650862; Supplier: Farnell
L2 = 74437429203680: WE-HCF SMT High Current Inductor, size 2920, 68uH, 11.2A, 24.42mOhm; Manufacturer: Wurth Elektronik; Self Resonant Frequency: 5.3MHz; DC Resistance typ.: 22.2mOhm; Saturation Current: 10.7A; ComponentLink1Description: Manufacturer; ComponentLink1URL: http://www.we-online.de; ComponentLink2Description: Datasheet; ComponentLink2URL: https://www.we-online.com/catalog/datasheet/74437429203680.pdf; Mounting Technology: SMT; Operating Temperature: -40 to +125degC; Packaging: Tray and Carton; Published Date: September 2020; DC Resistance max.: 24.42mOhm; Inductance: 68uH; Manufacturer Part Number: 74437429203680; Rated Current: 11.2A; Size: 2920
R18 R19 = 100K/0603/0063W/50V: as R28 on sheet ReboostV2_CAN; Case Style: 0603; Order Code Supplier: 2122619; Power Rating: 0.063W; Price: 0,039; Resistance: 100K; Supplier: Farnell; Temperature Coefficient: ± 100PPM; Temperature Range: -55°C to +125°C; Voltage Rating: 50V
R20 R21 = NTCS0805E4104JMT: NTC, 100K, 25°C, 0.5%, 0.210W, 0805; Brand: VISHAY BC COMPONENTS; Case Style: 0805; Brand Number: NTCS0805E4104JMT; Order Code Supplier: 1187095; Power Rating: 0.210W; Price: 0,59; Resistance: 100K; Supplier: Farnell; Temperature Range: -55°C to +150°C; Type: NTC-100K

## Sheet ReboostV2__Isense.SchDoc: Current Sesnor
size 420 x 297 mm; SheetNumber: 4
Used 2 times, as channels PowerElectronics/ILS, PowerElectronics/IHS. Parts and nets are listed once, with the designators drawn on the sheet.
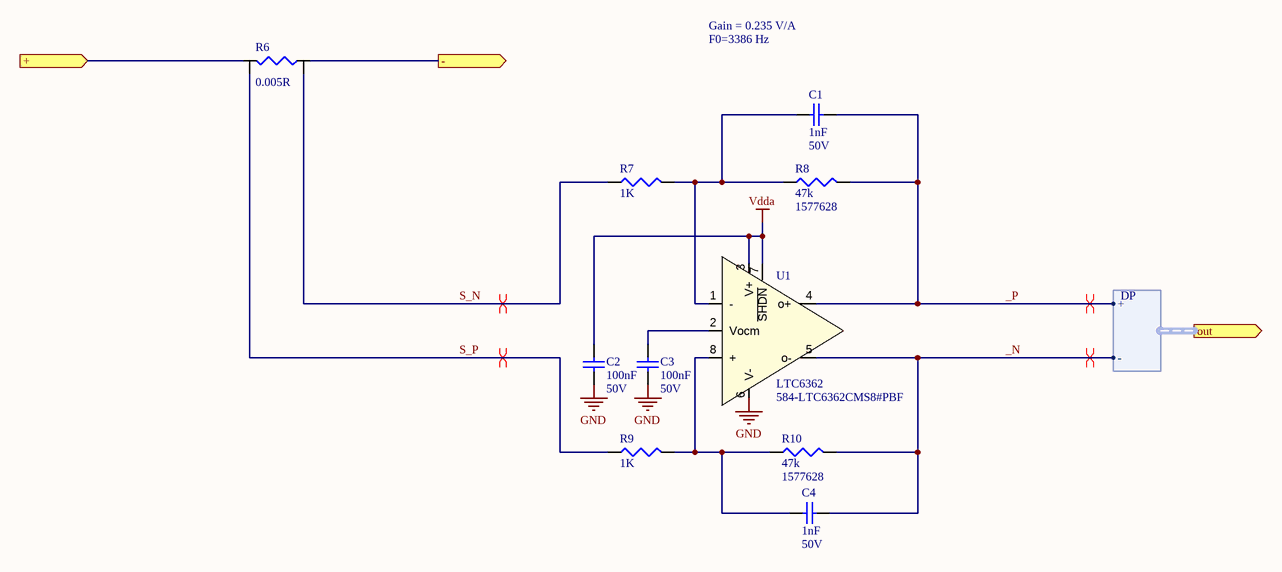
[diagram p5: ReboostV2__Isense.SchDoc]

### Parts
C1  1nF  Voltage Rating: 50V  [C0603]
C2  100nF  Voltage Rating: 50V  [C0603]
C3  100nF  Voltage Rating: 50V  [C0603]
C4  1nF  Voltage Rating: 50V  [C0603]
R6  0.005R  [2512-L-4T]
R7  1K  [0603]
R8  47k  Supplier Part Number 1: 1577628  [0603]
R9  1K  [0603]
R10  47k  Supplier Part Number 1: 1577628  [0603]
U1  LTC6362  Supplier Part Number 1: 584-LTC6362CMS8#PBF  [MSOP8]

### Ports
+ (in), - (out), out (out, harness DP)

### Harnesses
DP: +, -

### Nets
GND: C2.1 C3.1 U1.6(V-)
Vdda: C2.2 U1.3(V+) U1.7(~{SHDN})
+: R6.1 ; port +
-: R6.2 ; port -
_N: C4.2 R10.2 U1.5(o-) ; port out.-
_P: C1.2 R8.2 U1.4(o+) ; port out.+
S_N: R6.4 R7.1
S_P: R6.3 R9.1
NetC1_1: C1.1 R7.2 R8.1 U1.1(-)
NetC3_2: C3.2 U1.2(Vocm)
NetC4_1: C4.1 R9.2 R10.1 U1.8(+)

### Channels
PowerElectronics/ILS: designators end in _ILS; ports +=GND -=VLN
PowerElectronics/IHS: designators end in _IHS; ports +=GND -=VHN

### Layout directives
differential pair: _N, _P, S_N_ILS, S_P_ILS

### Notes on the sheet
- Gain = 0.235 V/A
- F0=3386 Hz
- PROJECT
- www.tpee.nl <http://www.tpee.nl>
- TITLE
- FILE NAME
- A3
- SIZE
- Author:
- SHEET
- OF

### Library data of the parts
C1 C4 = 1nF/0603/CER/50V: Capacitor, 1nF, 50V, X7R; Capacitance Tolerance: ± 10%; Capacitor Case Style: 0603; Brand Number: C0603C102K5RACTU; Brand: KEMET; Dielectric Characteristic: X7R; Capacitance: 1nF; Temperature Range: -55°C to +125°C; Price: 0,011; Order Code Supplier: 1414608; Supplier: Farnell
C2 C3 = 100nF/0603/CER/50V: as C31 on sheet ReboostV2_CAN; Dielectric Characteristic: X7R; Capacitance: 100nF; Temperature Range: -55°C to +125°C; Price: 0,008; Order Code Supplier: 1759122RL; Supplier: Farnell
R6 = 0.005/2512/2000W/200V: Resistor, 0.005R, 1%, 2W, 50PPM; Brand: OHMITE; Brand Number: FC4L64R005FER; Case Style: 2512; Voltage Rating: 200V; Order Code Supplier: 2363991; Power Rating: 2W; Price: 3,07; Resistance: 0.005R; Supplier: Farnell; Temperature Coefficient: ± 50PPM; Temperature Range: -55°C to +170°C
R7 R9 = 1K/0603/0063W/50V: Resistor, 1K, 1%, 0.063W, 50V, 100PPM, 0603; Brand: VISHAY DRALORIC; Brand Number: CRCW06031K00FKEA; Case Style: 0603; Order Code Supplier: 2122366; Power Rating: 0.063W; Price: 0,039; Resistance: 1K; Supplier: Farnell; Temperature Coefficient: ± 100PPM; Temperature Range: -55°C to +125°C; Voltage Rating: 50V
R8 R10 = 47K/0603/0063W/50V_1: Resistor, 47K, 0.1%, 0.063W, 50V, 100PPM, 0603; Case Style: 0603; Power Rating: 0.063W; Resistance: 47k; Supplier: Farnell; Temperature Coefficient: ± 100PPM; Temperature Range: -55°C to +125°C; Voltage Rating: 50V; Supplier 1: Farnell
U1 = LTC6362HMS8: Precision, Low Power Rail-to-Rail Input/Output Differential Op Amp; Supplier 1: Mouser

## Sheet ReboostV2__Vsense.SchDoc: Voltage Sensor
size 420 x 297 mm; SheetNumber: 5
Used 2 times, as channels PowerElectronics/VLS, PowerElectronics/VHS. Parts and nets are listed once, with the designators drawn on the sheet.
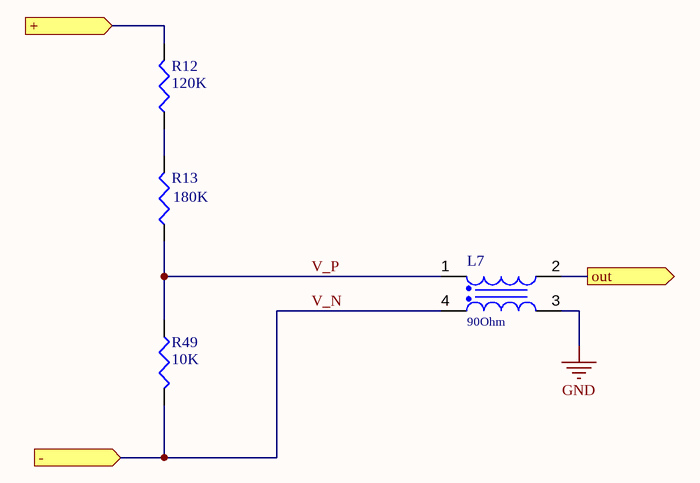
[diagram p6: ReboostV2__Vsense.SchDoc]

### Parts
L7  90Ohm  [WE-CNSW_0805]
R12  120K  [0603]
R13  180K  [0603]
R49  10K  [0603]

### Ports
+ (in), - (in), out (out)

### Nets
GND: L7.3
+: R12.2 ; port +
out: L7.2 ; port out
V_N: L7.4 R49.2 ; port -
V_P: L7.1 R13.1 R49.1
NetR12_1: R12.1 R13.2

### Channels
PowerElectronics/VLS: designators end in _VLS; ports +=VLP -=GND out=VLS
PowerElectronics/VHS: designators end in _VHS; ports +=Vb -=GND out=VHS

### Notes on the sheet
- PROJECT
- www.tpee.nl <http://www.tpee.nl>
- TITLE
- FILE NAME
- A3
- SIZE
- Author:
- SHEET
- OF

### Library data of the parts
L7 = 744231091: WE-CNSW SMT Common Mode Line Filter, size 0805, 90Ohm, 0.37A, 50V; Manufacturer: Wurth Elektronik; DC Resistance max.: 0.3Ohm; Impedance Test Condition: 100MHz; Insulation Test Voltage: 125VAC; Winding Style: bifiliar; ComponentLink1Description: Manufacturer; ComponentLink1URL: http://www.we-online.de; ComponentLink2Description: Datasheet; ComponentLink2URL: https://www.we-online.com/catalog/datasheet/744231091.pdf; Operating Temperature: -40 to +125degC; Packaging: Tape and Reel; Published Date: April 2020; Rated Current: 0.37A; Size: 0805; Impedance: 90Ohm; Manufacturer Part Number: 744231091; Rated Voltage: 50V; Mounting Technology: SMT
R12 = 120K/0603/0063W/50V: Resistor, 120K, 1%, 0.063W, 50V, 100PPM, 0603; Brand: VISHAY DRALORIC; Brand Number: CRCW0603120KFKEA; Case Style: 0603; Order Code Supplier: 2122628; Power Rating: 0.063W; Price: 0,038; Resistance: 120K; Supplier: Farnell; Temperature Coefficient: ± 100PPM; Temperature Range: -55°C to +125°C; Voltage Rating: 50V
R13 = 180K/0603/0063W/50V: Resistor, 180K, 1%, 0.063W, 50V, 100PPM, 0603; Brand: VISHAY DRALORIC; Brand Number: CRCW0603180KFKEA; Case Style: 0603; Order Code Supplier: 2122648; Power Rating: 0.063W; Price: 0,038; Resistance: 180K; Supplier: Farnell; Temperature Coefficient: ± 100PPM; Temperature Range: -55°C to +125°C; Voltage Rating: 50V
R49 = 10K/0603/0063W/50V: as R11 on sheet ReboostV2_USB; Case Style: 0603; Order Code Supplier: 2122493; Power Rating: 0.063W; Price: 0,038; Resistance: 10K; Supplier: Farnell; Temperature Coefficient: ± 100PPM; Temperature Range: -55°C to +125°C; Voltage Rating: 50V

## Sheet ReboostV2_Bridge.SchDoc: Halfe Bridge
size 420 x 297 mm; SheetNumber: 3
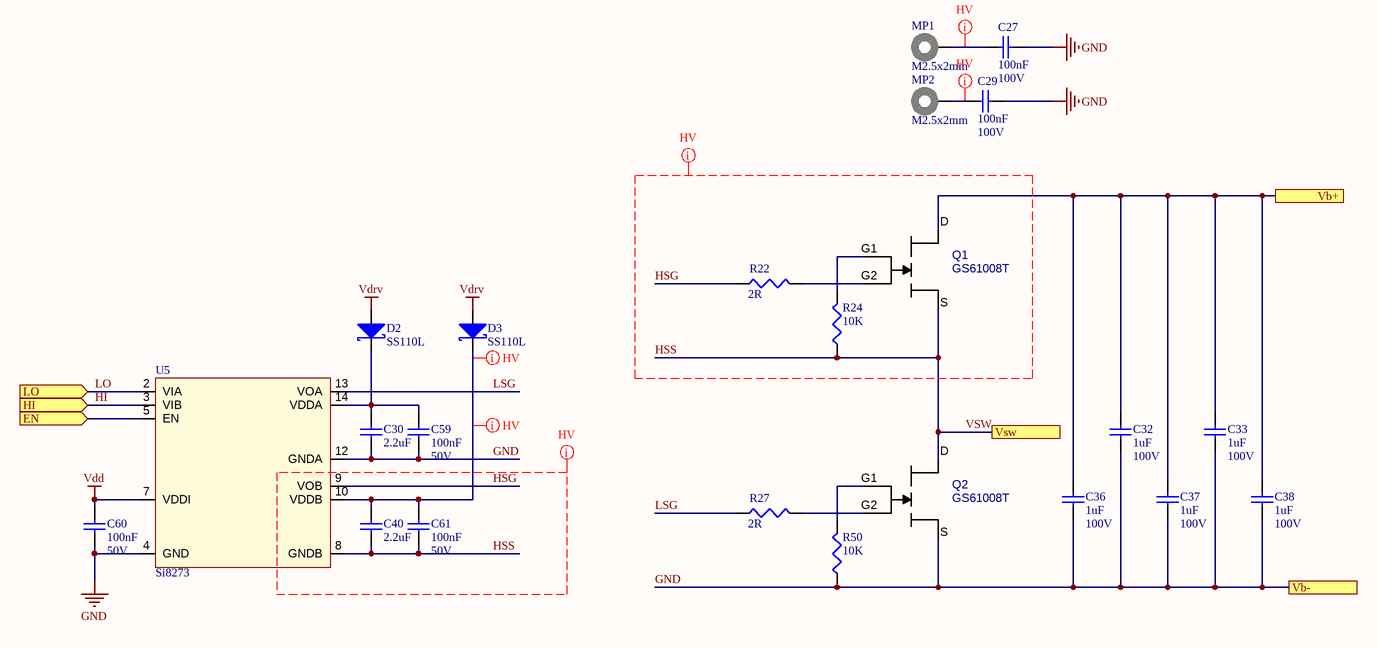
[diagram p7: ReboostV2_Bridge.SchDoc]

### Parts
C27  100nF  Voltage Rating: 100V  [C-0805]
C29  100nF  Voltage Rating: 100V  [C-0805]
C30  2.2uF  [C0603]
C32  1uF  Voltage Rating: 100V  [C-1206]
C33  1uF  Voltage Rating: 100V  [C-1206]
C36  1uF  Voltage Rating: 100V  [C-1206]
C37  1uF  Voltage Rating: 100V  [C-1206]
C38  1uF  Voltage Rating: 100V  [C-1206]
C40  2.2uF  [C0603]
C59  100nF  Voltage Rating: 50V  [C0603]
C60  100nF  Voltage Rating: 50V  [C0603]
C61  100nF  Voltage Rating: 50V  [C0603]
D2  SS110L  [SUB-SMA]
D3  SS110L  [SUB-SMA]
MP1  M2.5x2mm  [9774020151]
MP2  M2.5x2mm  [9774020151]
Q1  GS61008T  [GS61008T]
Q2  GS61008T  [GS61008T]
R22  2R  [0603]
R24  10K  [0603]
R27  2R  [0603]
R50  10K  [0603]
U5  Si8273  [DFN-14]

### Ports
EN (in), HI (in), LO (in), Vb+, Vb-, Vsw

### Nets
GND: C27.1 C29.1 C30.1 C32.1 C33.1 C36.1 C37.1 C38.1 C59.1 C60.1 Q2.S R50.1 U5.4(GND) U5.12(GNDA) ; port Vb-
Vdd: C60.2 U5.7(VDDI)
Vdrv: D2.1(A) D3.1(A)
DREN: U5.5(EN) ; port EN
HI: U5.3(VIB) ; port HI
HSG: R22.1 U5.9(VOB)
HSS: C40.1 C61.1 Q1.S Q2.D R24.1 U5.8(GNDB) ; port Vsw  [also labelled VSW]
LO: U5.2(VIA) ; port LO
LSG: R27.1 U5.13(VOA)
Vb: C32.2 C33.2 C36.2 C37.2 C38.2 Q1.D ; port Vb+
NetC27_2: C27.2 MP1.1
NetC29_2: C29.2 MP2.1
NetC30_2: C30.2 C59.2 D2.2(K) U5.14(VDDA)
NetC40_2: C40.2 C61.2 D3.2(K) U5.10(VDDB)
NetQ1_G1: Q1.G1 R24.2
NetQ1_G2: Q1.G2 R22.2
NetQ2_G1: Q2.G1 R50.2
NetQ2_G2: Q2.G2 R27.2

### Layout directives
net class HV: HSG, HSS, NetC27_2, NetC29_2, NetC40_2

### Notes on the sheet
- PROJECT
- www.tpee.nl <http://www.tpee.nl>
- TITLE
- FILE NAME
- A3
- SIZE
- Author:
- SHEET
- OF

### Library data of the parts
C27 C29 = 100nF/0805/CER/100V: as C43 on sheet ReboostV2_CAN; Dielectric Characteristic: X7R; Capacitance: 100nF; Temperature Range: -55°C to +125°C; Price: 0,096; Order Code Supplier: 1650862; Supplier: Farnell
C30 C40 = 2.2uF/0603/CER/16V: as C5 on sheet ReboostV2_USB; Dielectric Characteristic: X5R; Capacitance: 2.2uF; Temperature Range: -55°C to 85°C; Price: 0,077; Order Code Supplier: 1735526; Supplier: Farnell; Voltage Rating: 16V
C32 C33 C36-C38 = 1uF/1206/CER/100V: as C44 on sheet ReboostV2_CAN; Dielectric Characteristic: X7R; Capacitance: 1uF; Temperature Range: -55°C to +125°C; Price: 0,52; Order Code Supplier: 1833855; Supplier: Farnell
C59-C61 = 100nF/0603/CER/50V: as C31 on sheet ReboostV2_CAN; Dielectric Characteristic: X7R; Capacitance: 100nF; Temperature Range: -55°C to +125°C; Price: 0,008; Order Code Supplier: 1759122RL; Supplier: Farnell
D2 D3 = SS110L: Diode Schottky, Vrrm: 100V, If: 1A, Vf: 0.9V; Brand: TAIWAN SEMICONDUCTOR; Case Style: SMF; Brand Number: SS110L; Forward Current: 1A; Forward Voltage: 0.9V; Order Code Supplier: 1559156; Price: 0,191; Supplier: Farnell; Temperature Range: -55°C to +150°C; Vrrm: 100V
MP1 MP2 = 9774020151: as MP3 on sheet ReboostV2_CAN; ComponentLink1Description: Manufacturer; ComponentLink1URL: http://www.we-online.de; ComponentLink2Description: Datasheet; ComponentLink2URL: https://www.we-online.com/catalog/datasheet/9774020151.pdf; Mounting Technology: SMT; Packaging: Bulk; Manufacturer Part Number: 9774020151; Length: 2mm; Inner Thread Length: -; Operating Temperature: -55 to +150degC; Outer Diameter: 5.1mm; Published Date: April 2020; Material: Steel; Thread: M2.5
Q1 Q2 = GS61008T: GAN TRANS E-MODE 100V 90A TOP SIDE COOL
R22 R27 = 2/0603/0100W/75V: Resistor, 2R, 5%, 0.1W, 75V, 200PPM, 0603; Brand: PANASONIC; Brand Number: ERJ3GEYJ2R0V; Case Style: 0603; Order Code Supplier: 2059531; Power Rating: 0.1W; Price: 0,009; Resistance: 2R; Supplier: Farnell; Temperature Coefficient: ± 200PPM; Temperature Range: -55°C to +125°C; Voltage Rating: 75V
R24 R50 = 10K/0603/0063W/50V: as R11 on sheet ReboostV2_USB; Case Style: 0603; Order Code Supplier: 2122493; Power Rating: 0.063W; Price: 0,038; Resistance: 10K; Supplier: Farnell; Temperature Coefficient: ± 100PPM; Temperature Range: -55°C to +125°C; Voltage Rating: 50V
U5 = Si8273ABIM1: 4 Amp ISOdriver with High Transient (dV/dt) Immunity; Supplier 1: Mouser; Supplier 2: Digi-Key; Supplier Part Number 1: 634-SI8273AB-IM1; Supplier Part Number 2: 336-5932-ND

## Sheet ReboostV2_Power.SchDoc: Power Supply
size 420 x 297 mm; SheetNumber: 9
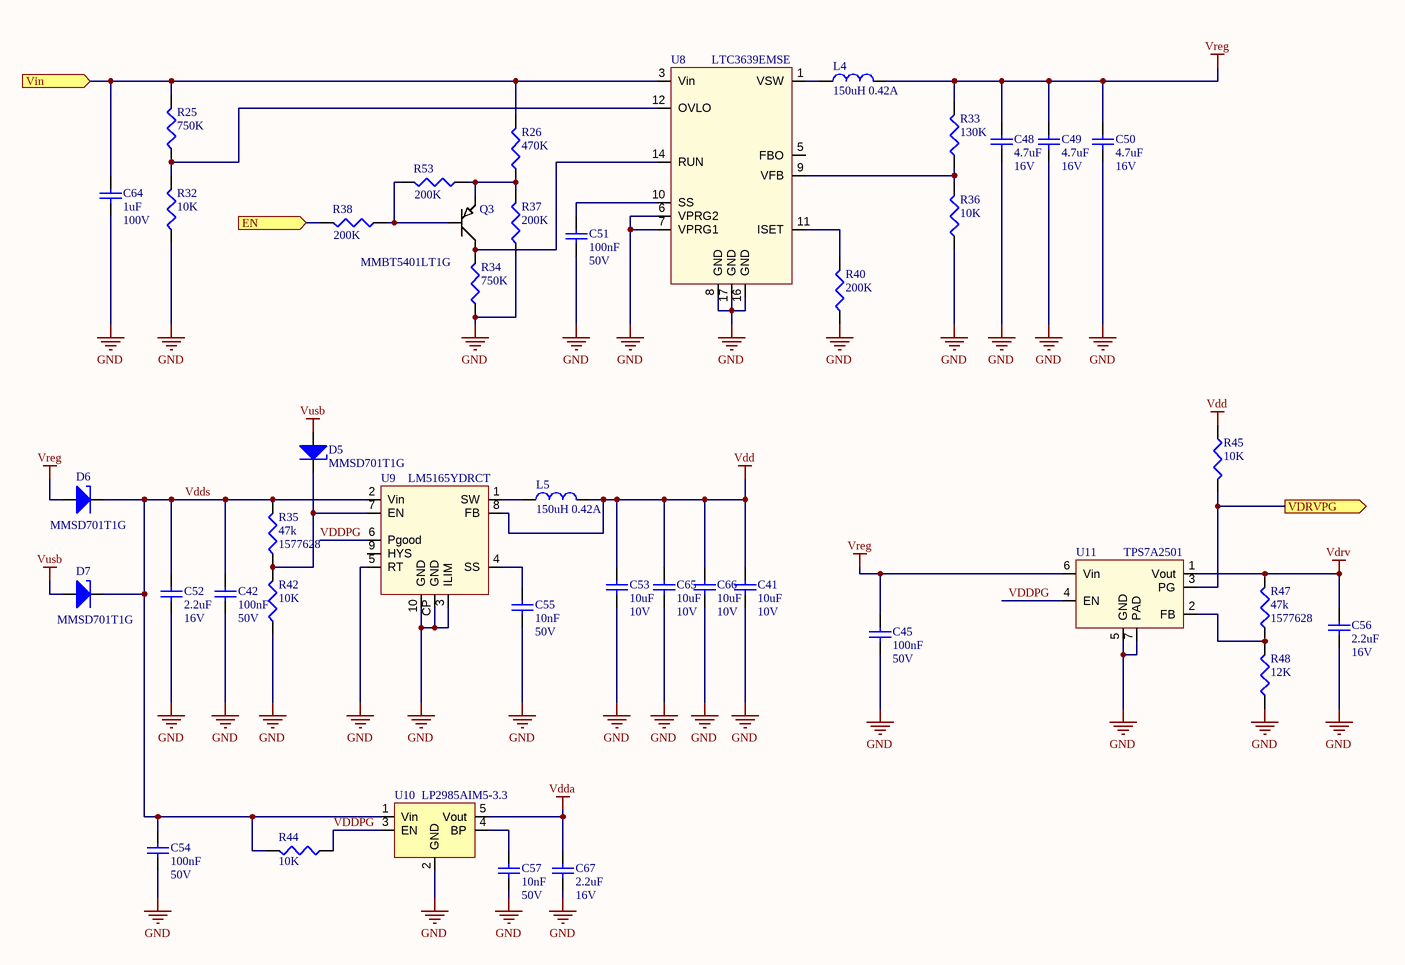
[diagram p8: ReboostV2_Power.SchDoc]

### Parts
C41  10uF  Voltage Rating: 10V  [C-0805]
C42  100nF  Voltage Rating: 50V  [C0603]
C45  100nF  Voltage Rating: 50V  [C0603]
C48  4.7uF  Voltage Rating: 16V  [C-0805]
C49  4.7uF  Voltage Rating: 16V  [C-0805]
C50  4.7uF  Voltage Rating: 16V  [C-0805]
C51  100nF  Voltage Rating: 50V  [C0603]
C52  2.2uF  Voltage Rating: 16V  [C0603]
C53  10uF  Voltage Rating: 10V  [C-0805]
C54  100nF  Voltage Rating: 50V  [C0603]
C55  10nF  Voltage Rating: 50V  [C0603]
C56  2.2uF  Voltage Rating: 16V  [C0603]
C57  10nF  Voltage Rating: 50V  [C0603]
C64  1uF  Voltage Rating: 100V  [C-1206]
C65  10uF  Voltage Rating: 10V  [C-0805]
C66  10uF  Voltage Rating: 10V  [C-0805]
C67  2.2uF  Voltage Rating: 16V  [C0603]
D5  MMSD701T1G  [SOD123 - B]
D6  MMSD701T1G  [SOD123 - B]
D7  MMSD701T1G  [SOD123 - B]
L4  150uH 0.42A  [WE-TPC 4828, MH]
L5  150uH 0.42A  [WE-TPC 4828, MH]
Q3  MMBT5401LT1G  [SOT-23]
R25  750K  [0603]
R26  470K  [0603]
R32  10K  [0603]
R33  130K  [0603]
R34  750K  [0603]
R35  47k  Supplier Part Number 1: 1577628  [0603]
R36  10K  [0603]
R37  200K  [0603]
R38  200K  [0603]
R40  200K  [0603]
R42  10K  [0603]
R44  10K  [0603]
R45  10K  [0603]
R47  47k  Supplier Part Number 1: 1577628  [0603]
R48  12K  [0603]
R53  200K  [0603]
U8  LTC3639EMSE  [MSE1612]
U9  LM5165YDRCT  [PWSON10]
U10  LP2985AIM5-3.3  [SOT-23-5]
U11  TPS7A2501  [WSON-6]

### Ports
EN (in), VDRVPG (out), Vin (in)

### Nets
GND: C41.1 C42.1 C45.1 C48.1 C49.1 C50.1 C51.1 C52.1 C53.1 C54.1 C55.1 C56.1 C57.1 C64.1 C65.1 C66.1 C67.1 R32.1 R34.1 R36.1 R37.1 R40.1 R42.1 R48.1 U8.6(VPRG2) U8.7(VPRG1) U8.8(GND) U8.16(GND) U8.17(GND) U9.3(ILIM) U9.5(RT) U9.10(GND) U9.CP(GND) U10.2(GND) U11.5(GND) U11.7(PAD)
Vdd: C41.2 C53.2 C65.2 C66.2 L5.2 R45.1 U9.8(FB)
Vdda: C67.2 U10.5(Vout)
Vdrv: C56.2 R47.2 U11.1(Vout)
Vreg: C45.2 C48.2 C49.2 C50.2 D6.1(A) L4.2 R33.2 U11.6(Vin)
Vusb: D5.1(A) D7.1(A)
Vb: C64.2 R25.2 R26.2 U8.3(Vin) ; port Vin
VDDPG: R44.1 U9.6(Pgood) U10.3(EN) U11.4(EN)
Vdds: C42.2 C52.2 C54.2 D6.2(K) D7.2(K) R35.2 R44.2 U9.2(Vin) U10.1(Vin)
VDRVPG: R45.2 U11.3(PG) ; port VDRVPG
NetC51_2: C51.2 U8.10(SS)
NetC55_2: C55.2 U9.4(SS)
NetC57_2: C57.2 U10.4(BP)
NetD5_2: D5.2(K) R35.1 R42.2 U9.7(EN)
NetL4_1: L4.1 U8.1(VSW)
NetL5_1: L5.1 U9.1(SW)
NetQ3_1: Q3.1 R38.1 R53.2
NetQ3_2: Q3.2 R26.1 R37.2 R53.1
NetQ3_3: Q3.3 R34.2 U8.14(RUN)
NetR25_1: R25.1 R32.2 U8.12(OVLO)
NetR33_1: R33.1 R36.2 U8.9(VFB)
NetR38_2: R38.2 ; port EN
NetR40_2: R40.2 U8.11(ISET)
NetR47_1: R47.1 R48.2 U11.2(FB)

Not connected (* = marked no-connect by the designer): U8 5(FBO); U9 9(HYS)

### Notes on the sheet
- PROJECT
- www.tpee.nl <http://www.tpee.nl>
- TITLE
- FILE NAME
- A3
- SIZE
- Author:
- SHEET
- OF

### Library data of the parts
C41 C53 C65 C66 = 10uF/0805/CER/10V: as C46 on sheet ReboostV2_CAN; Dielectric Characteristic: X7R; Capacitance: 10uF; Temperature Range: -55°C to +125°C; Price: 0,36; Order Code Supplier: 1828828; Supplier: Farnell
C42 C45 C51 C54 = 100nF/0603/CER/50V: as C31 on sheet ReboostV2_CAN; Dielectric Characteristic: X7R; Capacitance: 100nF; Temperature Range: -55°C to +125°C; Price: 0,008; Order Code Supplier: 1759122RL; Supplier: Farnell
C48-C50 = 4.7uF/0805/CER/16V: Capacitor, 4.7uF, 16V, X7R; Capacitance Tolerance: ± 10%; Capacitor Case Style: 0805; Brand Number: GRM21BR71C475KA73L; Brand: MURATA; Dielectric Characteristic: X7R; Capacitance: 4.7uF; Temperature Range: -55°C to +125°C; Price: 0,26; Order Code Supplier: 1797015; Supplier: Farnell
C52 C56 C67 = 2.2uF/0603/CER/16V: as C5 on sheet ReboostV2_USB; Dielectric Characteristic: X5R; Capacitance: 2.2uF; Temperature Range: -55°C to 85°C; Price: 0,077; Order Code Supplier: 1735526; Supplier: Farnell
C55 C57 = 10nF/0603/CER/50V: as C47 on sheet ReboostV2_CAN; Dielectric Characteristic: X7R; Capacitance: 10nF; Temperature Range: -55°C to +125°C; Price: 0,011; Order Code Supplier: 1414609; Supplier: Farnell
C64 = 1uF/1206/CER/100V: as C44 on sheet ReboostV2_CAN; Dielectric Characteristic: X7R; Capacitance: 1uF; Temperature Range: -55°C to +125°C; Price: 0,52; Order Code Supplier: 1833855; Supplier: Farnell
D5-D7 = MMSD701T1G: Diode Schottky, Vrrm: 70V, If: 0.2A, Vf: 0.5V; Brand: ON SEMICONDUCTOR; Case Style: SOD-123; Brand Number: MMSD701T1G; Forward Current: 0.2A; Forward Voltage: 0.5V; Order Code Supplier: 1431102; Price: 0,115; Supplier: Farnell; Temperature Range: -55°C to +125°C; Vrrm: 70V
L4 L5 = 744043151: as L3 on sheet ReboostV2_CAN; Brand Number: 744043151; DC Current: 0.42A; Inductance: 150uH; Order Code Supplier: 2082517; Price: 1,36; Q Factor: *; Supplier: Farnell; Temperature Range: -40°C to +125°C
Q3 = MMBT5401LT1G: Transistor, PNP, Vce:-150V, Vcb:-160V, Veb:-5V, Ic:-0,5A, Hfe:60 to 240; Brand: ON SEMICONDUCTOR; Collector Current: -0.5A; Collector Emittor Voltage: 160V; Base Emittor Voltage: 6V; Brand Number: MMBT5401LT1G; Case Style: SOT-23; Hfe: 60 to 240; Order Code Supplier: 1459108; Price: 0,041; Supplier: Farnell; Temperature Range: -55°C to +150°C; Transistor Polarity: PNP
R25 R34 = 750K/0603/0063W/50V: Resistor, 750K, 1%, 0.063W, 50V, 100PPM, 0603; Brand: VISHAY DRALORIC; Brand Number: CRCW0603750KFKEA; Case Style: 0603; Order Code Supplier: 2122731; Power Rating: 0.063W; Price: 0,038; Resistance: 750K; Supplier: Farnell; Temperature Coefficient: ± 100PPM; Temperature Range: -55°C to +125°C; Voltage Rating: 50V
R26 = 470K/0603/0063W/50V: Resistor, 470K, 1%, 0.063W, 50V, 100PPM, 0603; Brand: VISHAY DRALORIC; Brand Number: CRCW0603470KFKEA; Case Style: 0603; Order Code Supplier: 2122703; Power Rating: 0.063W; Price: 0,038; Resistance: 470K; Supplier: Farnell; Temperature Coefficient: ± 100PPM; Temperature Range: -55°C to +125°C; Voltage Rating: 50V
R32 R36 R42 R44 R45 = 10K/0603/0063W/50V: as R11 on sheet ReboostV2_USB; Case Style: 0603; Order Code Supplier: 2122493; Power Rating: 0.063W; Price: 0,038; Resistance: 10K; Supplier: Farnell; Temperature Coefficient: ± 100PPM; Temperature Range: -55°C to +125°C; Voltage Rating: 50V
R33 = 130K/0603/0063W/50V: Resistor, 130K, 1%, 0.063W, 50V, 100PPM, 0603; Brand: VISHAY DRALORIC; Brand Number: CRCW0603130KFKEA; Case Style: 0603; Order Code Supplier: 2122632; Power Rating: 0.063W; Price: 0,017; Resistance: 130K; Supplier: Farnell; Temperature Coefficient: ± 100PPM; Temperature Range: -55°C to +125°C; Voltage Rating: 50V
R35 R47 = 47K/0603/0063W/50V_1: as R8 on sheet ReboostV2__Isense; Case Style: 0603; Power Rating: 0.063W; Resistance: 47k; Supplier: Farnell; Temperature Coefficient: ± 100PPM; Temperature Range: -55°C to +125°C; Voltage Rating: 50V; Supplier 1: Farnell
R37 R38 R53 = 200K/0603/0063W/50V: Resistor, 200K, 1%, 0.063W, 50V, 100PPM, 0603; Brand: VISHAY DRALORIC; Brand Number: CRCW0603200KFKEA; Case Style: 0603; Order Code Supplier: 2122655; Power Rating: 0.063W; Price: 0,038; Resistance: 200K; Supplier: Farnell; Temperature Coefficient: ± 100PPM; Temperature Range: -55°C to +125°C; Voltage Rating: 50V
R40 = 200K/0603/0100W/75V: Resistor, 200K, 1%, 0.1W, 75V, 100PPM, 0603; Brand: VISHAY DRALORIC; Brand Number: CRCW0603200KFKEA; Case Style: 0603; Order Code Supplier: 2122655; Power Rating: 0.1W; Price: 0,022; Resistance: 200K; Supplier: Farnell; Temperature Coefficient: ± 100PPM; Temperature Range: -55°C to +155°C; Voltage Rating: 75V
R48 = 12K/0603/0063W/50V: Resistor, 12K, 1%, 0.063W, 50V, 100PPM, 0603; Brand: VISHAY DRALORIC; Brand Number: CRCW060312K0FKEA; Case Style: 0603; Order Code Supplier: 2122501; Power Rating: 0.063W; Price: 0,0006; Resistance: 12K; Supplier: Farnell; Temperature Coefficient: ± 1%; Temperature Range: -55°C to +125°C; Voltage Rating: 50V
U8 = LTC3639EMSE: High Efficiency, 150V 100mA Synchronous Step-Down Regulator; ComponentLink1Description: New link; ComponentLink1URL: *
U9 = LM5165Y: Buck Vreg 150mA 3V3 out 5-65Vin; Brand: Texas Instruments; Case Style: MSOP-8; Price: 3,70; Order Code Supplier: 595-LM5165YDRCT; Brand Number: LM5165YDRCT; Temperature Range: -40°C to +85°C; Supplier: Mouser
U10 = LP2985AIM5-3.3: LDO, 0.3VDO, 3.3V, 0.15A, 1%; Brand: TEXAS INSTRUMENTS; Brand Number: LP2985AIM5-3.3/NOPB; Vin-min: 3.6V; Vin-max: 5.5V; Case Style: SOT-23-5; Current: 0.15A; Vout: 3.3V; Order Code Supplier: 1469134; Price: 0,73; Supplier: Farnell; Temperature Range: -40°C to +85°C
U11 = TPS7A2501DRVT: TPS7A25 300-mA,18-V, Ultra-LowIQ, Low-DropoutLinearVoltageRegulatorWith Power-Good; Supplier 1: Digi-Key; Supplier 2: Mouser; Supplier Part Number 1: 296-TPS7A2501DRVTCT-ND; Supplier Part Number 2: 595-TPS7A2501DRVT

## Nets that join several sheets
GND: ReboostV2_toplevel (8 pins), ReboostV2_CAN (C31.1 D4.3 U6.4), ReboostV2_USB (9 pins), ReboostV2_MC (19 pins), ReboostV2_Phase (10 pins), PowerElectronics/ILS (C2_ILS.1 C3_ILS.1 R6_ILS.1 U1_ILS.6), PowerElectronics/IHS (C2_IHS.1 C3_IHS.1 R6_IHS.1 U1_IHS.6), PowerElectronics/VLS (L7_VLS.3 L7_VLS.4 R49_VLS.2), PowerElectronics/VHS (L7_VHS.3 L7_VHS.4 R49_VHS.2), ReboostV2_Bridge (14 pins), ReboostV2_Power (36 pins)
Vdd: ReboostV2_toplevel (R1.2), ReboostV2_CAN (C31.2 U6.1), ReboostV2_MC (11 pins), ReboostV2_Phase (R18.2 R19.2), ReboostV2_Bridge (C60.2 U5.7), ReboostV2_Power (7 pins)
Vdda: ReboostV2_MC (C12.2 C13.2 U3.21), PowerElectronics/ILS (C2_ILS.2 U1_ILS.3 U1_ILS.7), PowerElectronics/IHS (C2_IHS.2 U1_IHS.3 U1_IHS.7), ReboostV2_Power (C67.2 U10.5)
Vdrv: ReboostV2_Bridge (D2.1 D3.1), ReboostV2_Power (C56.2 R47.2 U11.1)
Vusb: ReboostV2_USB (5 pins), ReboostV2_Power (D5.1 D7.1)
_N: ReboostV2_MC (U3.10), PowerElectronics/IHS (C4_IHS.2 R10_IHS.2 U1_IHS.5)
_N: ReboostV2_MC (U3.27), PowerElectronics/ILS (C4_ILS.2 R10_ILS.2 U1_ILS.5)
_P: ReboostV2_MC (U3.11), PowerElectronics/IHS (C1_IHS.2 R8_IHS.2 U1_IHS.4)
_P: ReboostV2_MC (U3.28), PowerElectronics/ILS (C1_ILS.2 R8_ILS.2 U1_ILS.4)
CANRX: ReboostV2_CAN (U6.3), ReboostV2_MC (U3.43)
CANTX: ReboostV2_CAN (U6.2), ReboostV2_MC (U3.44)
DREN: ReboostV2_MC (U3.42), ReboostV2_Bridge (U5.5)
HI: ReboostV2_MC (U4.7), ReboostV2_Bridge (U5.3)
HSS: ReboostV2_Phase (L2.1), ReboostV2_Bridge (6 pins)
LED0: ReboostV2_toplevel (R5.2), ReboostV2_MC (U3.4)
LED1: ReboostV2_toplevel (R4.2), ReboostV2_MC (U3.3)
LED2: ReboostV2_toplevel (R3.2), ReboostV2_MC (U3.2)
LED3: ReboostV2_toplevel (R2.2), ReboostV2_MC (U3.47)
LO: ReboostV2_MC (U4.3), ReboostV2_Bridge (U5.2)
NetD4_4: ReboostV2_toplevel (R41.1 S1.1), ReboostV2_CAN (D4.4)
NetR38_2: ReboostV2_toplevel (R39.2 R41.2 S1.3 S1.4), ReboostV2_Power (R38.2)
RX: ReboostV2_USB (U2.21), ReboostV2_MC (U3.40)
Tamb: ReboostV2_MC (U3.30), ReboostV2_Phase (C21.2 R19.1 R21.2)
Tsink: ReboostV2_MC (U3.31), ReboostV2_Phase (C20.2 R18.1 R20.2)
TX: ReboostV2_USB (U2.20), ReboostV2_MC (U3.39)
Vb: ReboostV2_toplevel (L1.1), ReboostV2_Phase (6 pins), PowerElectronics/VHS (R12_VHS.2), ReboostV2_Bridge (6 pins), ReboostV2_Power (C64.2 R25.2 R26.2 U8.3)
VDRVPG: ReboostV2_MC (U3.45), ReboostV2_Power (R45.2 U11.3)
VHN: ReboostV2_toplevel (J1.4), PowerElectronics/IHS (R6_IHS.2)
VHS: ReboostV2_MC (U3.15), PowerElectronics/VHS (L7_VHS.2)
VLN: ReboostV2_toplevel (J1.1), ReboostV2_Phase (C34.2 C35.1), PowerElectronics/ILS (R6_ILS.2)
VLP: ReboostV2_toplevel (J1.2), ReboostV2_Phase (C34.1 C35.2 L2.2), PowerElectronics/VLS (R12_VLS.2)
VLS: ReboostV2_MC (U3.9), PowerElectronics/VLS (L7_VLS.2)